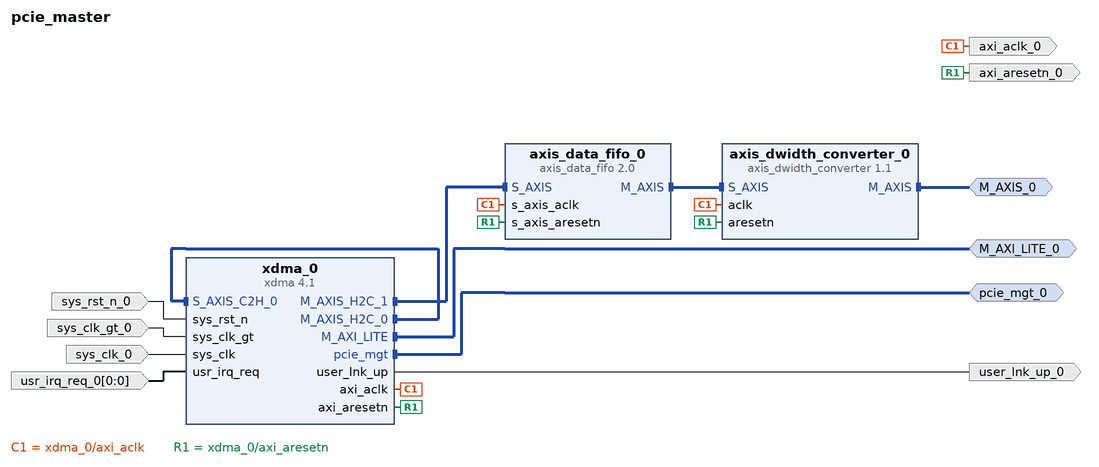
[diagram p0: block diagram of the top level]
# Vivado block design pcie_master, xcvu37p-fsvh2892-2-e, Vivado 2019.1.3
create_bd_design pcie_master

create_bd_intf_port -mode Master -vlnv xilinx.com:interface:axis_rtl:1.0 M_AXIS_0
set_property -dict {CONFIG.FREQ_HZ 125000000} [get_bd_intf_ports M_AXIS_0]
create_bd_intf_port -mode Master -vlnv xilinx.com:interface:pcie_7x_mgt_rtl:1.0 pcie_mgt_0
create_bd_intf_port -mode Master -vlnv xilinx.com:interface:aximm_rtl:1.0 M_AXI_LITE_0
set_property -dict [list \
  CONFIG.ADDR_WIDTH 32 \
  CONFIG.DATA_WIDTH 32 \
  CONFIG.FREQ_HZ 125000000 \
  CONFIG.HAS_BURST 0 \
  CONFIG.HAS_CACHE 0 \
  CONFIG.HAS_LOCK 0 \
  CONFIG.HAS_QOS 0 \
  CONFIG.HAS_REGION 0 \
  CONFIG.PROTOCOL AXI4LITE \
] [get_bd_intf_ports M_AXI_LITE_0]
create_bd_port -dir O user_lnk_up_0
create_bd_port -dir I -type rst sys_rst_n_0
create_bd_port -dir I -type clk sys_clk_gt_0
create_bd_port -dir I -type clk sys_clk_0
create_bd_port -dir I -from 0 -to 0 usr_irq_req_0
create_bd_port -dir O -type clk axi_aclk_0
set_property -dict {CONFIG.ASSOCIATED_BUSIF M_AXI_LITE_0:M_AXIS_0 CONFIG.FREQ_HZ 125000000} [get_bd_ports axi_aclk_0]
create_bd_port -dir O -type rst axi_aresetn_0

create_bd_cell -type ip -vlnv xilinx.com:ip:xdma:4.1 xdma_0
set_property -dict [list \
  CONFIG.axilite_master_en true \
  CONFIG.axilite_master_size 64 \
  CONFIG.axisten_freq 125 \
  CONFIG.cfg_mgmt_if false \
  CONFIG.mode_selection Advanced \
  CONFIG.pcie_blk_locn PCIE4C_X1Y0 \
  CONFIG.pcie_extended_tag false \
  CONFIG.pciebar2axibar_axil_master 0x10000000 \
  CONFIG.pf0_link_status_slot_clock_config false \
  CONFIG.pf0_msi_enabled false \
  CONFIG.xdma_axi_intf_mm AXI_Stream \
  CONFIG.xdma_axilite_slave false \
  CONFIG.xdma_rnum_chnl 2 \
] [get_bd_cells xdma_0]
create_bd_cell -type ip -vlnv xilinx.com:ip:axis_dwidth_converter:1.1 axis_dwidth_converter_0
set_property -dict {CONFIG.M_TDATA_NUM_BYTES 4} [get_bd_cells axis_dwidth_converter_0]
create_bd_cell -type ip -vlnv xilinx.com:ip:axis_data_fifo:2.0 axis_data_fifo_0

# ---- connections ----

connect_bd_intf_net [get_bd_intf_pins axis_data_fifo_0/M_AXIS] [get_bd_intf_pins axis_dwidth_converter_0/S_AXIS]
connect_bd_intf_net [get_bd_intf_pins xdma_0/M_AXIS_H2C_0] [get_bd_intf_pins xdma_0/S_AXIS_C2H_0]
connect_bd_intf_net [get_bd_intf_ports M_AXI_LITE_0] [get_bd_intf_pins xdma_0/M_AXI_LITE]
connect_bd_intf_net [get_bd_intf_ports M_AXIS_0] [get_bd_intf_pins axis_dwidth_converter_0/M_AXIS]
connect_bd_intf_net [get_bd_intf_ports pcie_mgt_0] [get_bd_intf_pins xdma_0/pcie_mgt]
connect_bd_intf_net [get_bd_intf_pins xdma_0/M_AXIS_H2C_1] [get_bd_intf_pins axis_data_fifo_0/S_AXIS]
connect_bd_net [get_bd_pins xdma_0/user_lnk_up] [get_bd_ports user_lnk_up_0]
connect_bd_net -net sys_rst_n_0_1 [get_bd_ports sys_rst_n_0] [get_bd_pins xdma_0/sys_rst_n]
connect_bd_net -net sys_clk_gt_0_1 [get_bd_ports sys_clk_gt_0] [get_bd_pins xdma_0/sys_clk_gt]
connect_bd_net -net sys_clk_0_1 [get_bd_ports sys_clk_0] [get_bd_pins xdma_0/sys_clk]
connect_bd_net -net usr_irq_req_0_1 [get_bd_ports usr_irq_req_0] [get_bd_pins xdma_0/usr_irq_req]
connect_bd_net [get_bd_pins xdma_0/axi_aclk] \
  [get_bd_ports axi_aclk_0] [get_bd_pins axis_data_fifo_0/s_axis_aclk] [get_bd_pins axis_dwidth_converter_0/aclk]
connect_bd_net [get_bd_pins xdma_0/axi_aresetn] \
  [get_bd_ports axi_aresetn_0] [get_bd_pins axis_data_fifo_0/s_axis_aresetn] [get_bd_pins axis_dwidth_converter_0/aresetn]

# ---- address map ----
assign_bd_address -offset 0x00000000 -range 64M -target_address_space [get_bd_addr_spaces xdma_0/M_AXI_LITE] [get_bd_addr_segs M_AXI_LITE_0/Reg]

validate_bd_design
save_bd_design
